# Altium schematic sheet Input Protection.SchDoc
size A4; Author: Wojciech Grędel; DocumentNumber: 1; Revision: 1; SheetNumber: 1
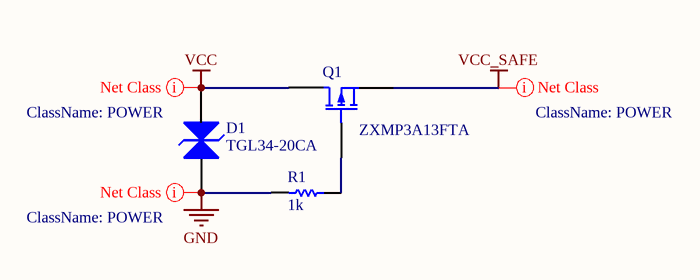
[diagram p0: Input Protection.SchDoc]

## Parts
D1  TGL34-20CA  [DIO_MELF_IPC_MD]
Q1  ZXMP3A13FTA  [SOT23_IPC_MD]
R1  value 1k  [RES_0603_IPC_HD]  (hidden comment: Res)

## Nets
GND: D1.1(IN1) R1.2
VCC: D1.2(IN2) Q1.3(D)
VCC_SAFE: Q1.2(S)
NetQ1_1: Q1.1(G) R1.1

## Layout directives
net class POWER: GND, VCC, VCC_SAFE

## Notes on the sheet
- Confidential / Not for distribution !
- Document name:
- Designer Name:
- Date/Time:
- Revision:

## Library data of the parts
D1 = TGL34-20CA: Transil
Q1 = ZXMP3A13FTA: P-mosfet
R1 = Res: Resistor